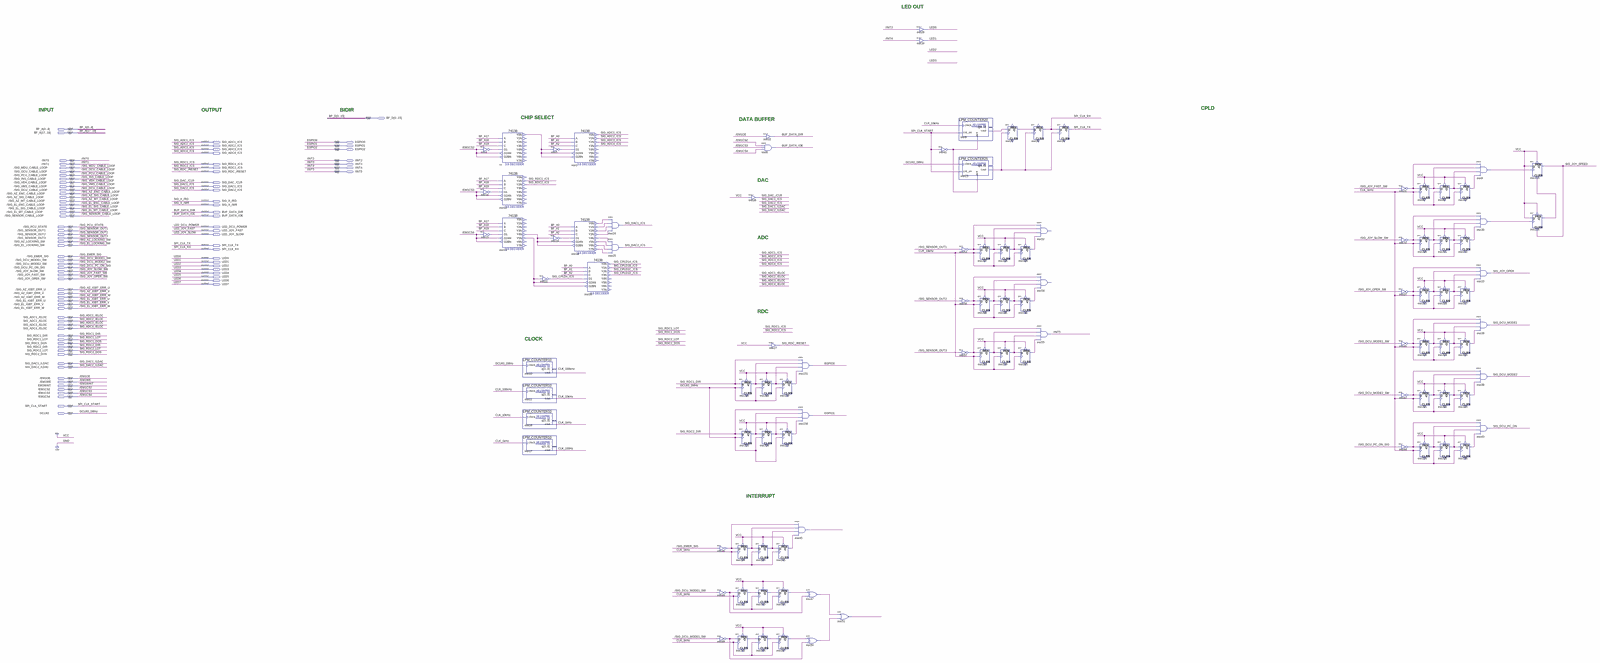
[diagram p0: schematic sheet, whole]
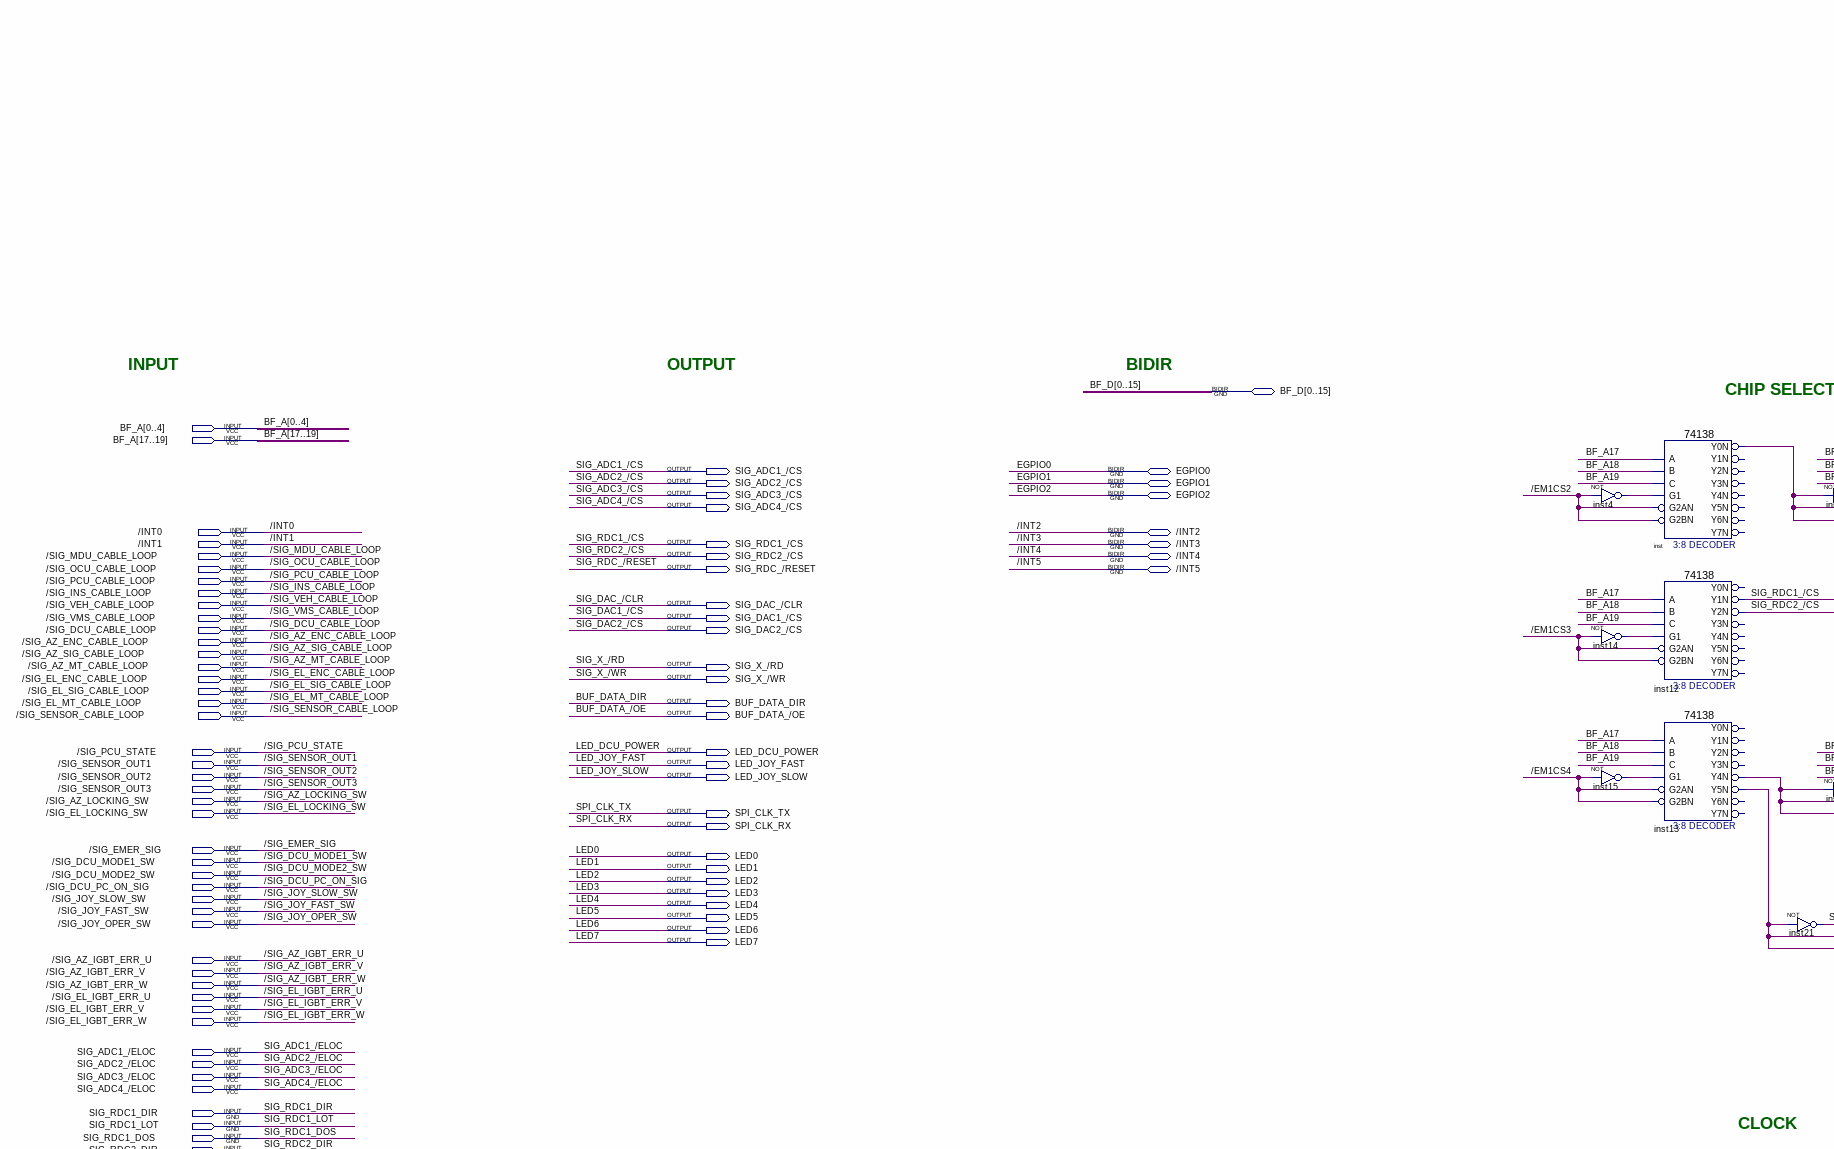
[diagram p1: schematic sheet, upper left part]
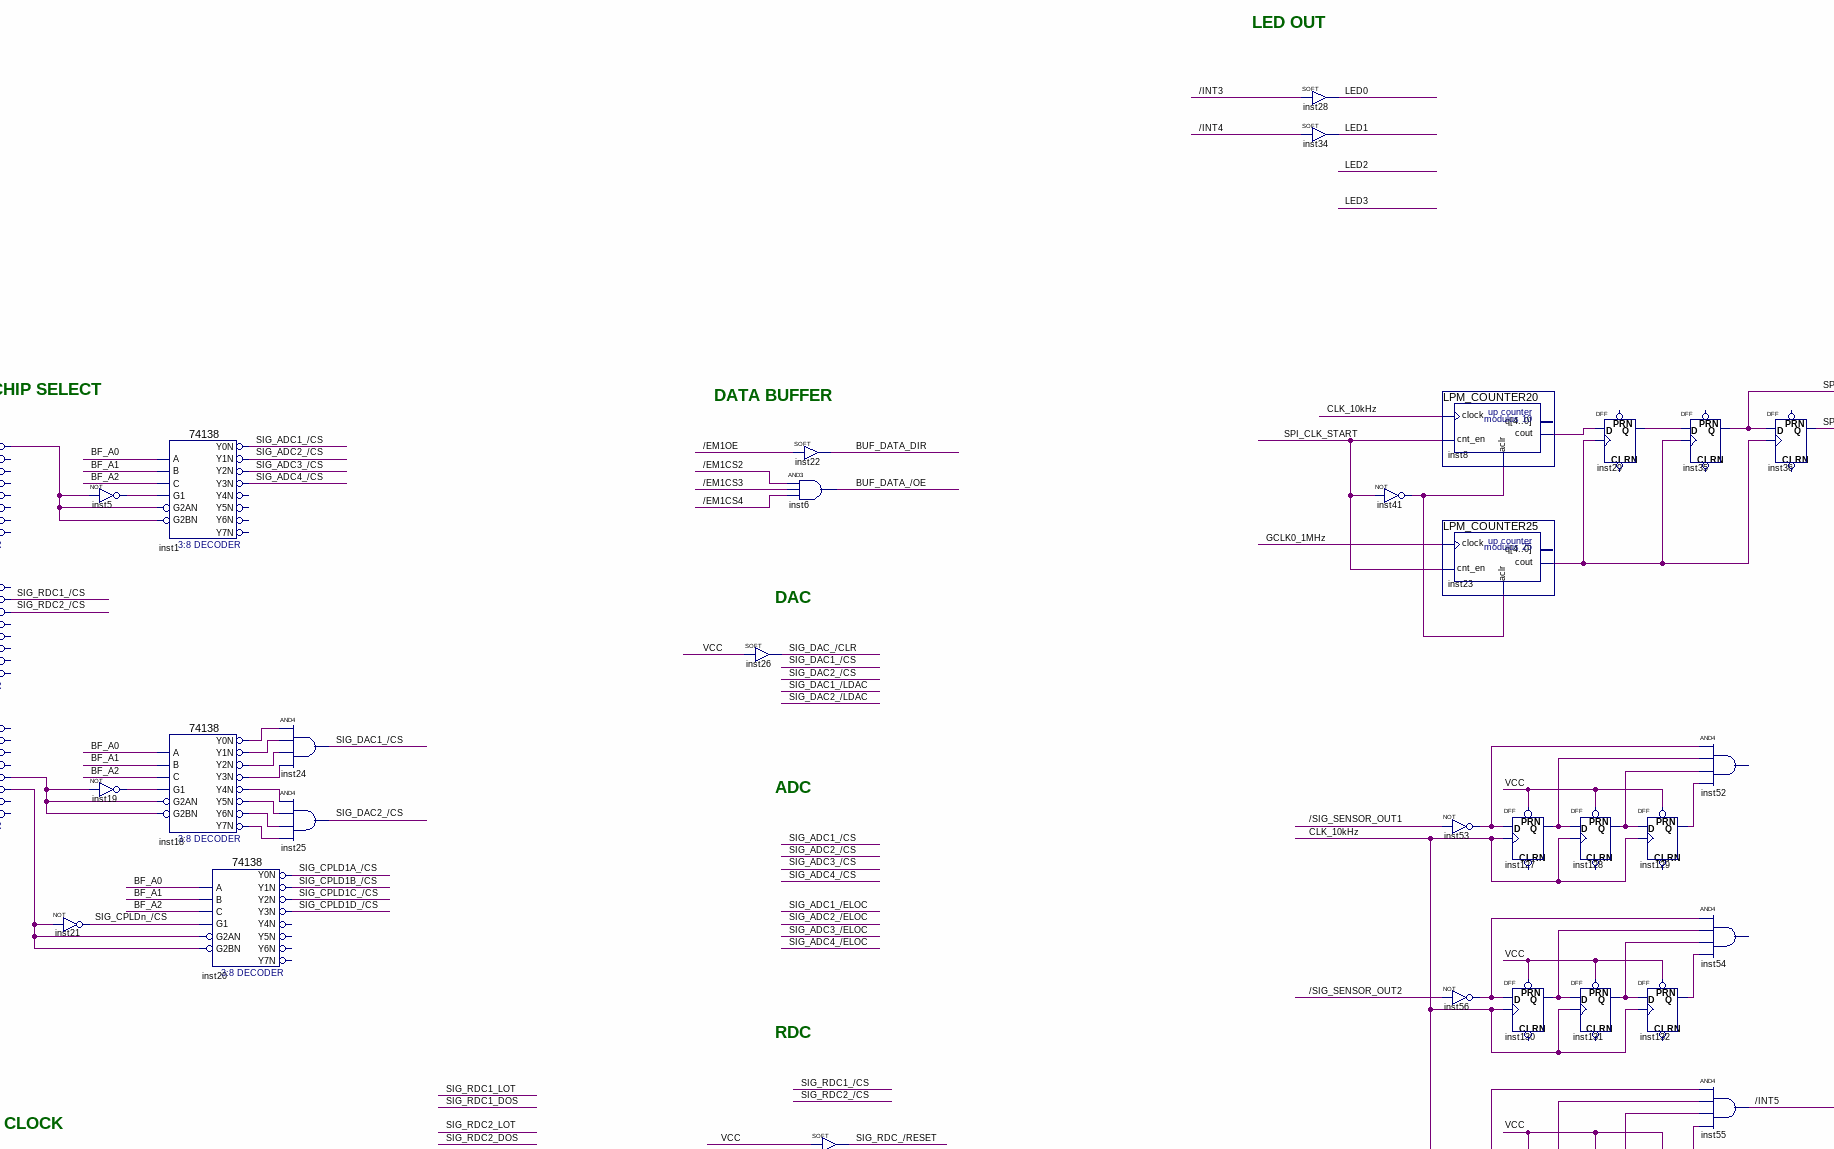
[diagram p2: schematic sheet, upper centre part]
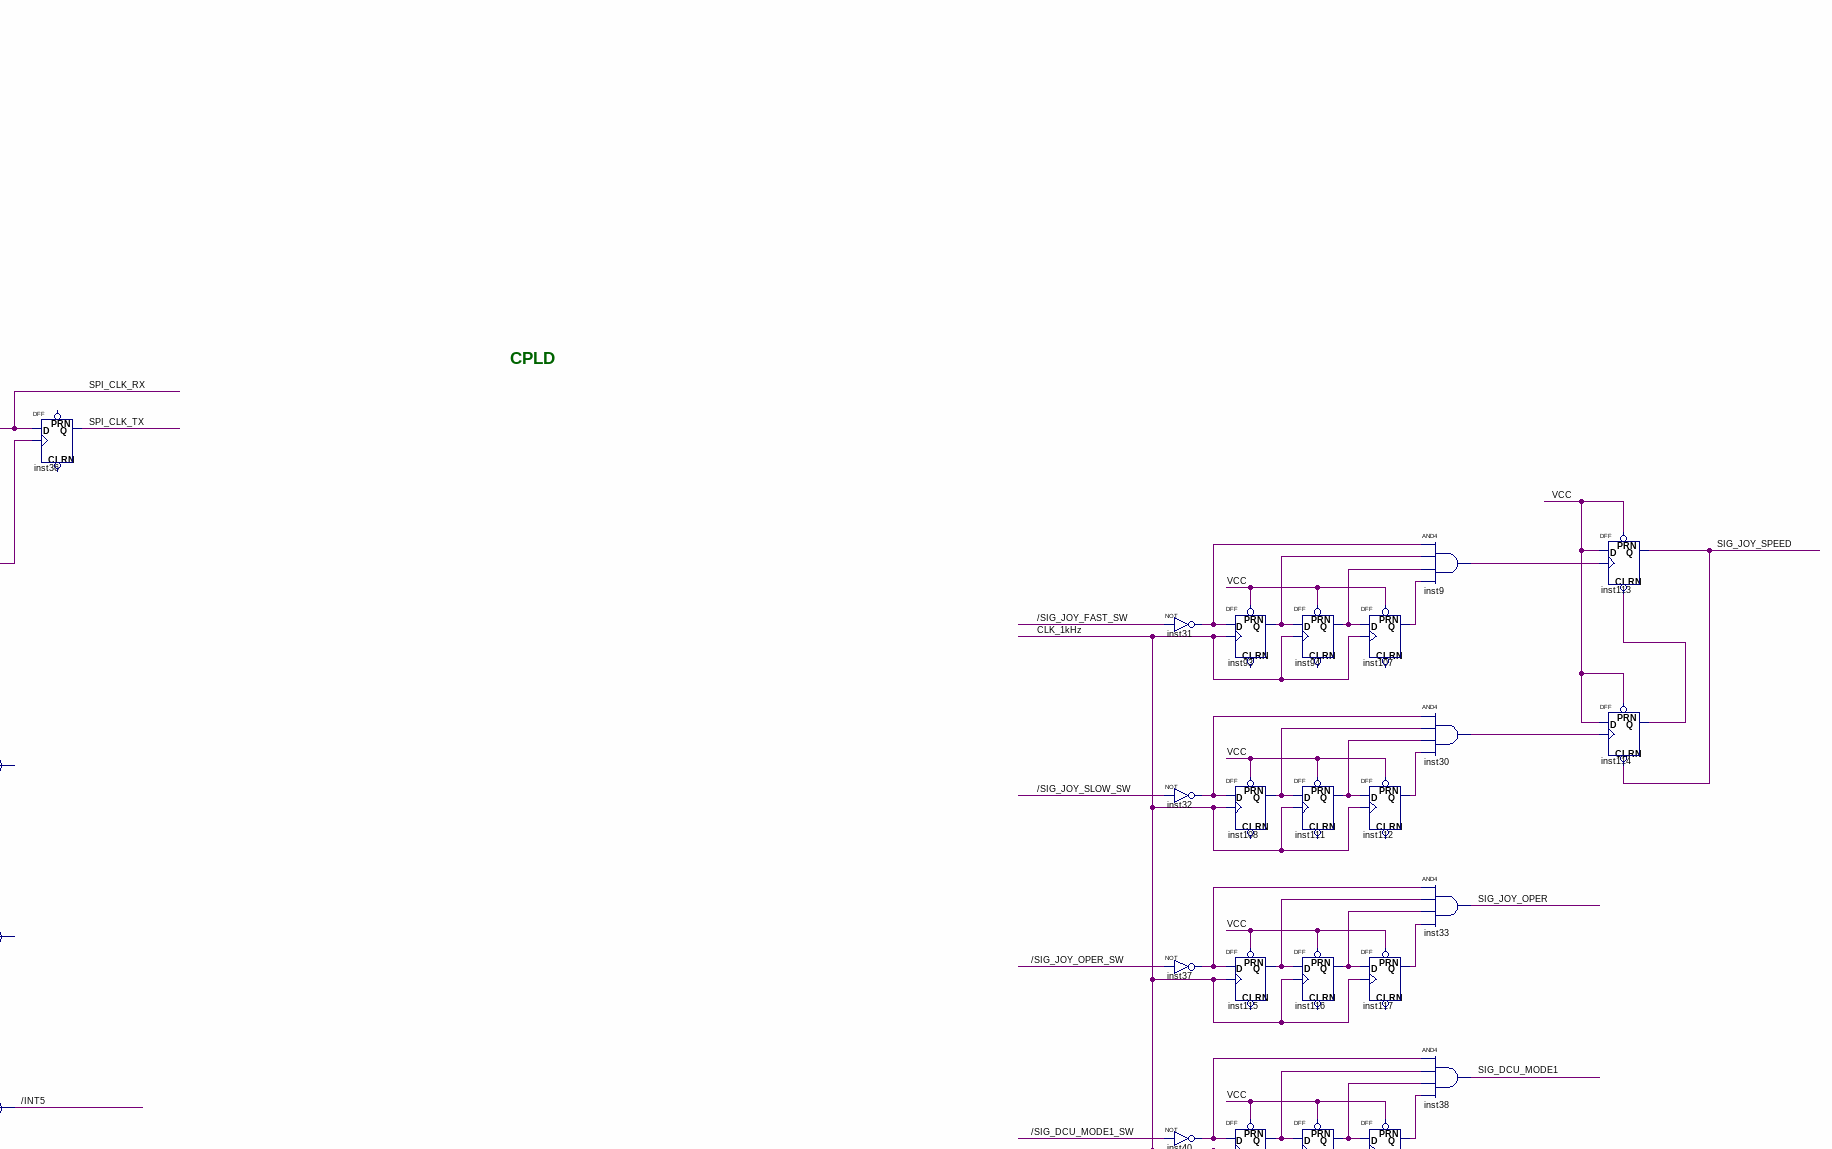
[diagram p3: schematic sheet, upper right part]
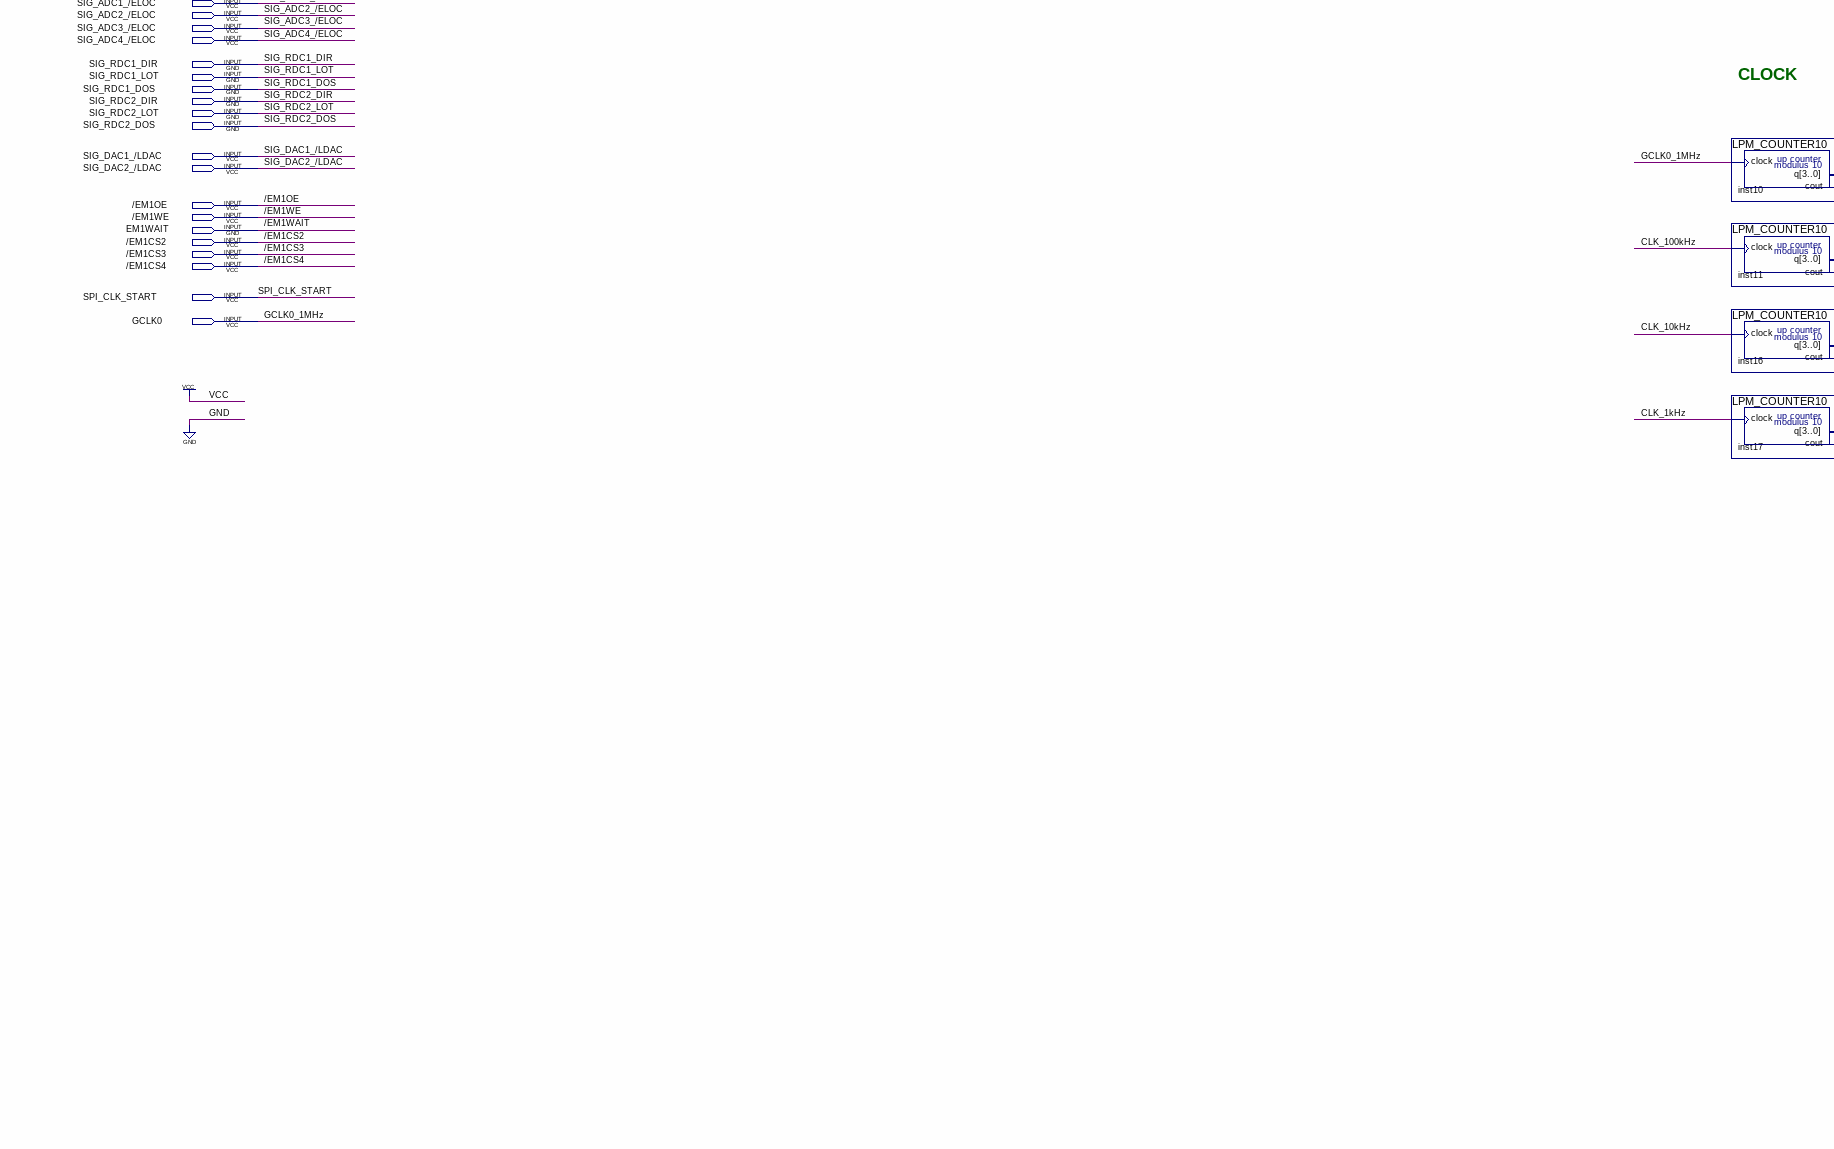
[diagram p4: schematic sheet, lower left part]
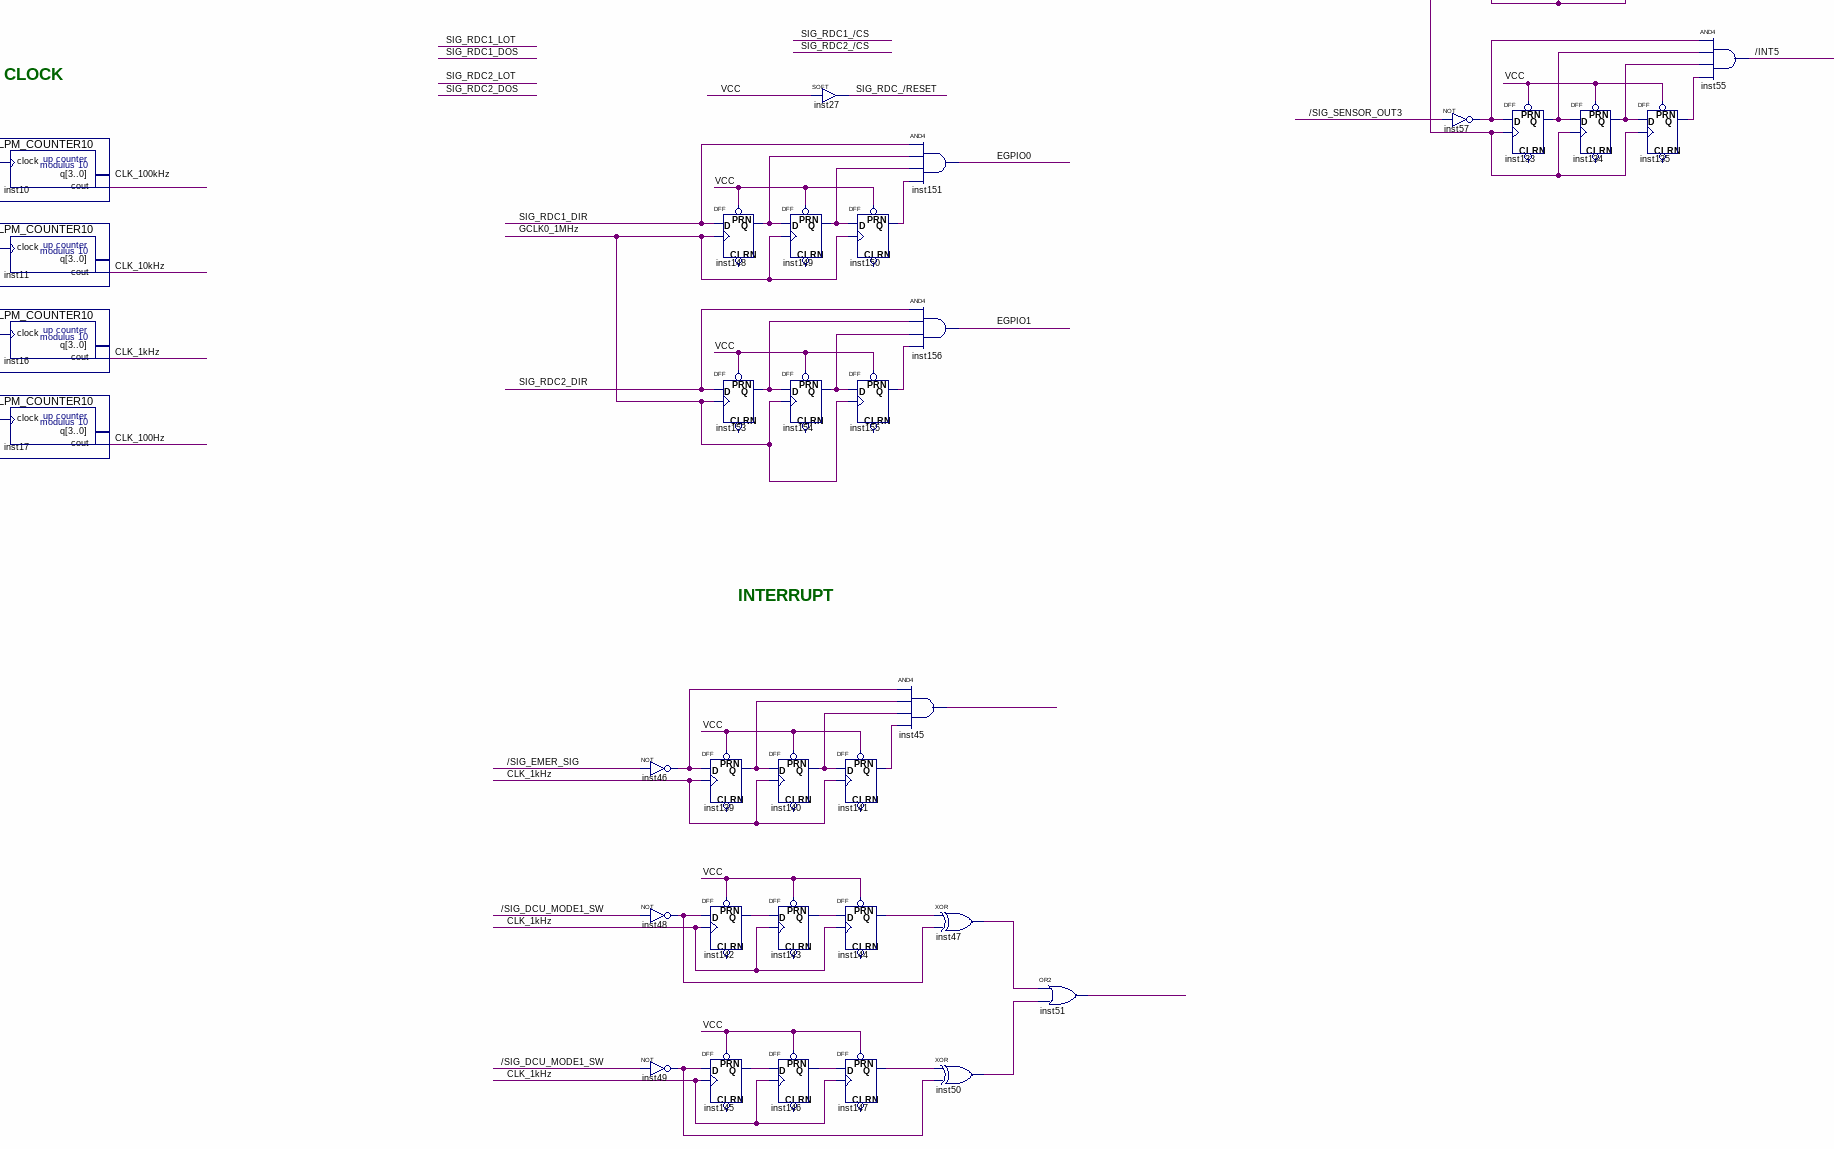
[diagram p5: schematic sheet, lower centre part]
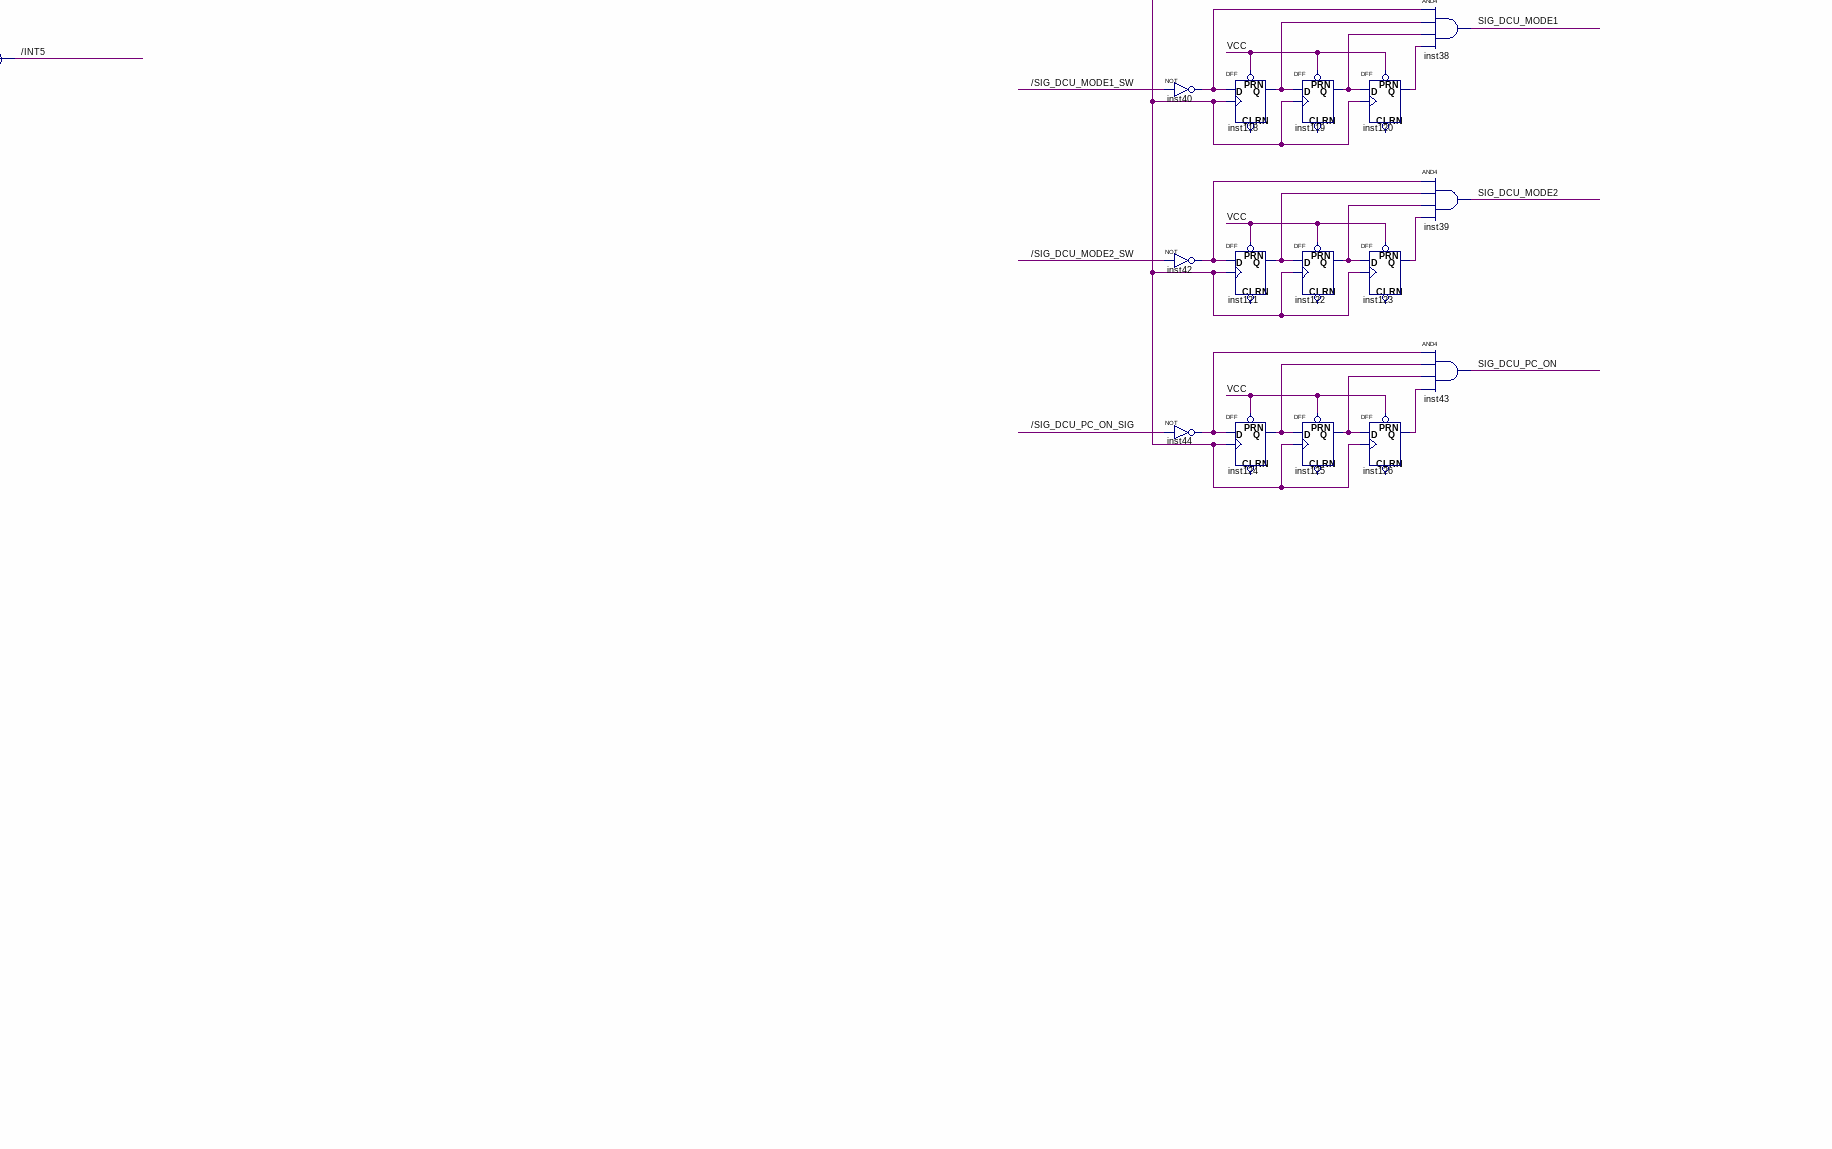
[diagram p6: schematic sheet, lower right part]
// Quartus schematic SPB_CPLD.bdf as structural Verilog: 101 symbols, 92 pins
module SPB_CPLD (
  input  [0:19] BF_A,
  input  \/INT0 ,
  input  \/INT1 ,
  input  \/SIG_MDU_CABLE_LOOP ,
  input  \/SIG_OCU_CABLE_LOOP ,
  input  \/SIG_PCU_CABLE_LOOP ,
  input  \/SIG_INS_CABLE_LOOP ,
  input  \/SIG_VEH_CABLE_LOOP ,
  input  \/SIG_VMS_CABLE_LOOP ,
  input  \/SIG_DCU_CABLE_LOOP ,
  input  \/SIG_AZ_ENC_CABLE_LOOP ,
  input  \/SIG_AZ_SIG_CABLE_LOOP ,
  input  \/SIG_AZ_MT_CABLE_LOOP ,
  input  \/SIG_EL_ENC_CABLE_LOOP ,
  input  \/SIG_EL_SIG_CABLE_LOOP ,
  input  \/SIG_EL_MT_CABLE_LOOP ,
  input  \/SIG_SENSOR_CABLE_LOOP ,
  input  \/SIG_PCU_STATE ,
  input  \/SIG_SENSOR_OUT1 ,
  input  \/SIG_SENSOR_OUT2 ,
  input  \/SIG_SENSOR_OUT3 ,
  input  \/SIG_AZ_LOCKING_SW ,
  input  \/SIG_EL_LOCKING_SW ,
  input  \/SIG_EMER_SIG ,
  input  \/SIG_DCU_MODE1_SW ,
  input  \/SIG_DCU_MODE2_SW ,
  input  \/SIG_DCU_PC_ON_SIG ,
  input  \/SIG_JOY_SLOW_SW ,
  input  \/SIG_JOY_FAST_SW ,
  input  \/SIG_JOY_OPER_SW ,
  input  \/SIG_AZ_IGBT_ERR_U ,
  input  \/SIG_AZ_IGBT_ERR_V ,
  input  \/SIG_AZ_IGBT_ERR_W ,
  input  \/SIG_EL_IGBT_ERR_U ,
  input  \/SIG_EL_IGBT_ERR_V ,
  input  \/SIG_EL_IGBT_ERR_W ,
  input  \SIG_ADC1_/ELOC ,
  input  \SIG_ADC2_/ELOC ,
  input  \SIG_ADC3_/ELOC ,
  input  \SIG_ADC4_/ELOC ,
  input  SIG_RDC1_DIR,
  input  SIG_RDC1_LOT,
  input  SIG_RDC1_DOS,
  input  SIG_RDC2_DIR,
  input  SIG_RDC2_LOT,
  input  SIG_RDC2_DOS,
  input  \SIG_DAC1_/LDAC ,
  input  \SIG_DAC2_/LDAC ,
  input  \/EM1OE ,
  input  \/EM1WE ,
  input  EM1WAIT,
  input  \/EM1CS2 ,
  input  \/EM1CS3 ,
  input  \/EM1CS4 ,
  input  SPI_CLK_START,
  input  GCLK0,
  inout  [0:15] BF_D,
  inout  EGPIO0,
  inout  EGPIO1,
  inout  EGPIO2,
  inout  \/INT2 ,
  inout  \/INT3 ,
  inout  \/INT4 ,
  inout  \/INT5 ,
  output \SIG_ADC1_/CS ,
  output \SIG_ADC2_/CS ,
  output \SIG_ADC3_/CS ,
  output \SIG_ADC4_/CS ,
  output \SIG_RDC1_/CS ,
  output \SIG_RDC2_/CS ,
  output \SIG_RDC_/RESET ,
  output \SIG_DAC_/CLR ,
  output \SIG_DAC1_/CS ,
  output \SIG_DAC2_/CS ,
  output \SIG_X_/RD ,
  output \SIG_X_/WR ,
  output BUF_DATA_DIR,
  output \BUF_DATA_/OE ,
  output LED_DCU_POWER,
  output LED_JOY_FAST,
  output LED_JOY_SLOW,
  output SPI_CLK_TX,
  output SPI_CLK_RX,
  output LED0,
  output LED1,
  output LED2,
  output LED3,
  output LED4,
  output LED5,
  output LED6,
  output LED7
);

  wire CLK_1kHz, CLK_10kHz, CLK_100Hz, CLK_100kHz, inst4_out, inst5_out, inst8_cout, inst9_out, inst13_y4n,
       inst13_y5n, inst14_out, inst15_out, inst18_y0n, inst18_y1n, inst18_y2n, inst18_y3n, inst18_y4n,
       inst18_y5n, inst18_y6n, inst18_y7n, inst19_out, inst23_cout, inst29_q, inst30_out, inst31_out,
       inst32_out, inst37_out, inst40_out, inst41_out, inst42_out, inst44_out, inst45_out, inst46_out,
       inst47_out, inst48_out, inst49_out, inst50_out, inst51_out, inst53_out, inst56_out, inst57_out,
       inst93_q, inst94_q, inst107_q, inst108_q, inst111_q, inst112_q, inst114_q, inst115_q, inst116_q,
       inst117_q, inst118_q, inst119_q, inst120_q, inst121_q, inst122_q, inst123_q, inst124_q, inst125_q,
       inst126_q, inst127_q, inst128_q, inst129_q, inst130_q, inst131_q, inst132_q, inst133_q, inst134_q,
       inst135_q, inst139_q, inst140_q, inst141_q, inst142_q, inst143_q, inst144_q, inst145_q, inst146_q,
       inst147_q, inst148_q, inst149_q, inst150_q, inst153_q, inst154_q, inst155_q, inst_y0n,
       \SIG_CPLD1A_/CS , \SIG_CPLD1B_/CS , \SIG_CPLD1C_/CS , \SIG_CPLD1D_/CS , \SIG_CPLDn_/CS ,
       SIG_DCU_MODE1, SIG_DCU_MODE2, SIG_DCU_PC_ON, SIG_JOY_OPER, SIG_JOY_SPEED;

  not inst4 (inst4_out, \/EM1CS2 );
  not inst14 (inst14_out, \/EM1CS3 );
  not inst15 (inst15_out, \/EM1CS4 );
  \74138  inst (
    .A(BF_A[17]), .B(BF_A[18]), .G1(inst4_out), .C(BF_A[19]), .G2AN(\/EM1CS2 ), .G2BN(\/EM1CS2 ),
    .Y0N(inst_y0n));  // open: Y1N, Y2N, Y3N, Y4N, Y5N, Y6N, Y7N
  \74138  inst12 (
    .A(BF_A[17]), .B(BF_A[18]), .G1(inst14_out), .C(BF_A[19]), .G2AN(\/EM1CS3 ), .G2BN(\/EM1CS3 ),
    .Y1N(\SIG_RDC1_/CS ), .Y2N(\SIG_RDC2_/CS ));  // open: Y0N, Y3N, Y4N, Y5N, Y6N, Y7N
  \74138  inst13 (
    .A(BF_A[17]), .B(BF_A[18]), .G1(inst15_out), .C(BF_A[19]), .G2AN(\/EM1CS4 ), .G2BN(\/EM1CS4 ),
    .Y4N(inst13_y4n), .Y5N(inst13_y5n));  // open: Y0N, Y1N, Y2N, Y3N, Y6N, Y7N
  LPM_COUNTER10 inst10 (.clock(GCLK0), .cout(CLK_100kHz));  // open: q
  LPM_COUNTER10 inst11 (.clock(CLK_100kHz), .cout(CLK_10kHz));  // open: q
  LPM_COUNTER10 inst16 (.clock(CLK_10kHz), .cout(CLK_1kHz));  // open: q
  LPM_COUNTER10 inst17 (.clock(CLK_1kHz), .cout(CLK_100Hz));  // open: q
  not inst5 (inst5_out, inst_y0n);
  not inst19 (inst19_out, inst13_y4n);
  not inst21 (\SIG_CPLDn_/CS , inst13_y5n);
  \74138  inst1 (
    .A(BF_A[0]), .B(BF_A[1]), .G1(inst5_out), .C(BF_A[2]), .G2AN(inst_y0n), .G2BN(inst_y0n),
    .Y0N(\SIG_ADC1_/CS ), .Y1N(\SIG_ADC2_/CS ), .Y2N(\SIG_ADC3_/CS ), .Y3N(\SIG_ADC4_/CS ));  // open: Y4N, Y5N, Y6N, Y7N
  \74138  inst18 (
    .A(BF_A[0]), .B(BF_A[1]), .G1(inst19_out), .C(BF_A[2]), .G2AN(inst13_y4n), .G2BN(inst13_y4n),
    .Y0N(inst18_y0n), .Y1N(inst18_y1n), .Y2N(inst18_y2n), .Y3N(inst18_y3n), .Y4N(inst18_y4n),
    .Y5N(inst18_y5n), .Y6N(inst18_y6n), .Y7N(inst18_y7n));
  \74138  inst20 (
    .A(BF_A[0]), .B(BF_A[1]), .G1(\SIG_CPLDn_/CS ), .C(BF_A[2]), .G2AN(inst13_y5n), .G2BN(inst13_y5n),
    .Y0N(\SIG_CPLD1A_/CS ), .Y1N(\SIG_CPLD1B_/CS ), .Y2N(\SIG_CPLD1C_/CS ), .Y3N(\SIG_CPLD1D_/CS ));  // open: Y4N, Y5N, Y6N, Y7N
  and inst24 (\SIG_DAC1_/CS , inst18_y0n, inst18_y1n, inst18_y2n, inst18_y3n);
  and inst25 (\SIG_DAC2_/CS , inst18_y4n, inst18_y5n, inst18_y6n, inst18_y7n);
  not inst46 (inst46_out, \/SIG_EMER_SIG );
  not inst48 (inst48_out, \/SIG_DCU_MODE1_SW );
  not inst49 (inst49_out, \/SIG_DCU_MODE1_SW );
  DFF inst148 (.CLK(GCLK0), .D(SIG_RDC1_DIR), .PRN(1'b1), .Q(inst148_q));  // open: CLRN
  DFF inst153 (.CLK(GCLK0), .D(SIG_RDC2_DIR), .PRN(1'b1), .Q(inst153_q));  // open: CLRN
  DFF inst139 (.CLK(CLK_1kHz), .D(inst46_out), .PRN(1'b1), .Q(inst139_q));  // open: CLRN
  DFF inst142 (.CLK(CLK_1kHz), .D(inst48_out), .PRN(1'b1), .Q(inst142_q));  // open: CLRN
  DFF inst145 (.CLK(CLK_1kHz), .D(inst49_out), .PRN(1'b1), .Q(inst145_q));  // open: CLRN
  SOFT inst26 (.IN(1'b1), .OUT(\SIG_DAC_/CLR ));
  DFF inst149 (.CLK(GCLK0), .D(inst148_q), .PRN(1'b1), .Q(inst149_q));  // open: CLRN
  DFF inst154 (.CLK(GCLK0), .D(inst153_q), .PRN(1'b1), .Q(inst154_q));  // open: CLRN
  DFF inst140 (.CLK(CLK_1kHz), .D(inst139_q), .PRN(1'b1), .Q(inst140_q));  // open: CLRN
  DFF inst143 (.CLK(CLK_1kHz), .D(inst142_q), .PRN(1'b1), .Q(inst143_q));  // open: CLRN
  DFF inst146 (.CLK(CLK_1kHz), .D(inst145_q), .PRN(1'b1), .Q(inst146_q));  // open: CLRN
  SOFT inst22 (.IN(\/EM1OE ), .OUT(BUF_DATA_DIR));
  and inst6 (\BUF_DATA_/OE , \/EM1CS2 , \/EM1CS3 , \/EM1CS4 );
  SOFT inst27 (.IN(1'b1), .OUT(\SIG_RDC_/RESET ));
  DFF inst150 (.CLK(GCLK0), .D(inst149_q), .PRN(1'b1), .Q(inst150_q));  // open: CLRN
  DFF inst155 (.CLK(GCLK0), .D(inst154_q), .PRN(1'b1), .Q(inst155_q));  // open: CLRN
  DFF inst141 (.CLK(CLK_1kHz), .D(inst140_q), .PRN(1'b1), .Q(inst141_q));  // open: CLRN
  DFF inst144 (.CLK(CLK_1kHz), .D(inst143_q), .PRN(1'b1), .Q(inst144_q));  // open: CLRN
  DFF inst147 (.CLK(CLK_1kHz), .D(inst146_q), .PRN(1'b1), .Q(inst147_q));  // open: CLRN
  and inst151 (EGPIO0, SIG_RDC1_DIR, inst148_q, inst149_q, inst150_q);
  and inst156 (EGPIO1, SIG_RDC2_DIR, inst153_q, inst154_q, inst155_q);
  and inst45 (inst45_out, inst46_out, inst139_q, inst140_q, inst141_q);
  xor inst47 (inst47_out, inst144_q, inst48_out);
  xor inst50 (inst50_out, inst147_q, inst49_out);
  or inst51 (inst51_out, inst47_out, inst50_out);
  SOFT inst28 (.IN(\/INT3 ), .OUT(LED0));
  SOFT inst34 (.IN(\/INT4 ), .OUT(LED1));
  not inst41 (inst41_out, SPI_CLK_START);
  LPM_COUNTER20 inst8 (.clock(CLK_10kHz), .cnt_en(SPI_CLK_START), .aclr(inst41_out), .cout(inst8_cout));  // open: q
  LPM_COUNTER25 inst23 (.clock(GCLK0), .cnt_en(SPI_CLK_START), .aclr(inst41_out), .cout(inst23_cout));  // open: q
  not inst53 (inst53_out, \/SIG_SENSOR_OUT1 );
  not inst56 (inst56_out, \/SIG_SENSOR_OUT2 );
  not inst57 (inst57_out, \/SIG_SENSOR_OUT3 );
  DFF inst127 (.CLK(CLK_10kHz), .D(inst53_out), .PRN(1'b1), .Q(inst127_q));  // open: CLRN
  DFF inst130 (.CLK(CLK_10kHz), .D(inst56_out), .PRN(1'b1), .Q(inst130_q));  // open: CLRN
  DFF inst133 (.CLK(CLK_10kHz), .D(inst57_out), .PRN(1'b1), .Q(inst133_q));  // open: CLRN
  DFF inst29 (.CLK(inst23_cout), .D(inst8_cout), .Q(inst29_q));  // open: CLRN, PRN
  DFF inst128 (.CLK(CLK_10kHz), .D(inst127_q), .PRN(1'b1), .Q(inst128_q));  // open: CLRN
  DFF inst131 (.CLK(CLK_10kHz), .D(inst130_q), .PRN(1'b1), .Q(inst131_q));  // open: CLRN
  DFF inst134 (.CLK(CLK_10kHz), .D(inst133_q), .PRN(1'b1), .Q(inst134_q));  // open: CLRN
  DFF inst129 (.CLK(CLK_10kHz), .D(inst128_q), .PRN(1'b1), .Q(inst129_q));  // open: CLRN
  DFF inst132 (.CLK(CLK_10kHz), .D(inst131_q), .PRN(1'b1), .Q(inst132_q));  // open: CLRN
  DFF inst135 (.CLK(CLK_10kHz), .D(inst134_q), .PRN(1'b1), .Q(inst135_q));  // open: CLRN
  DFF inst35 (.CLK(inst23_cout), .D(inst29_q), .Q(SPI_CLK_RX));  // open: CLRN, PRN
  // AND4 inst52 has open pins: IN1=inst53_out, IN2=inst127_q, IN3=inst128_q, IN4=inst129_q, OUT=open
  // AND4 inst54 has open pins: IN1=inst56_out, IN2=inst130_q, IN3=inst131_q, IN4=inst132_q, OUT=open
  and inst55 (\/INT5 , inst57_out, inst133_q, inst134_q, inst135_q);
  DFF inst36 (.CLK(inst23_cout), .D(SPI_CLK_RX), .Q(SPI_CLK_TX));  // open: CLRN, PRN
  not inst31 (inst31_out, \/SIG_JOY_FAST_SW );
  not inst32 (inst32_out, \/SIG_JOY_SLOW_SW );
  not inst37 (inst37_out, \/SIG_JOY_OPER_SW );
  not inst40 (inst40_out, \/SIG_DCU_MODE1_SW );
  not inst42 (inst42_out, \/SIG_DCU_MODE2_SW );
  not inst44 (inst44_out, \/SIG_DCU_PC_ON_SIG );
  DFF inst93 (.CLK(CLK_1kHz), .D(inst31_out), .PRN(1'b1), .Q(inst93_q));  // open: CLRN
  DFF inst108 (.CLK(CLK_1kHz), .D(inst32_out), .PRN(1'b1), .Q(inst108_q));  // open: CLRN
  DFF inst115 (.CLK(CLK_1kHz), .D(inst37_out), .PRN(1'b1), .Q(inst115_q));  // open: CLRN
  DFF inst118 (.CLK(CLK_1kHz), .D(inst40_out), .PRN(1'b1), .Q(inst118_q));  // open: CLRN
  DFF inst121 (.CLK(CLK_1kHz), .D(inst42_out), .PRN(1'b1), .Q(inst121_q));  // open: CLRN
  DFF inst124 (.CLK(CLK_1kHz), .D(inst44_out), .PRN(1'b1), .Q(inst124_q));  // open: CLRN
  DFF inst94 (.CLK(CLK_1kHz), .D(inst93_q), .PRN(1'b1), .Q(inst94_q));  // open: CLRN
  DFF inst111 (.CLK(CLK_1kHz), .D(inst108_q), .PRN(1'b1), .Q(inst111_q));  // open: CLRN
  DFF inst116 (.CLK(CLK_1kHz), .D(inst115_q), .PRN(1'b1), .Q(inst116_q));  // open: CLRN
  DFF inst119 (.CLK(CLK_1kHz), .D(inst118_q), .PRN(1'b1), .Q(inst119_q));  // open: CLRN
  DFF inst122 (.CLK(CLK_1kHz), .D(inst121_q), .PRN(1'b1), .Q(inst122_q));  // open: CLRN
  DFF inst125 (.CLK(CLK_1kHz), .D(inst124_q), .PRN(1'b1), .Q(inst125_q));  // open: CLRN
  DFF inst107 (.CLK(CLK_1kHz), .D(inst94_q), .PRN(1'b1), .Q(inst107_q));  // open: CLRN
  DFF inst112 (.CLK(CLK_1kHz), .D(inst111_q), .PRN(1'b1), .Q(inst112_q));  // open: CLRN
  DFF inst117 (.CLK(CLK_1kHz), .D(inst116_q), .PRN(1'b1), .Q(inst117_q));  // open: CLRN
  DFF inst120 (.CLK(CLK_1kHz), .D(inst119_q), .PRN(1'b1), .Q(inst120_q));  // open: CLRN
  DFF inst123 (.CLK(CLK_1kHz), .D(inst122_q), .PRN(1'b1), .Q(inst123_q));  // open: CLRN
  DFF inst126 (.CLK(CLK_1kHz), .D(inst125_q), .PRN(1'b1), .Q(inst126_q));  // open: CLRN
  and inst9 (inst9_out, inst31_out, inst93_q, inst94_q, inst107_q);
  and inst30 (inst30_out, inst32_out, inst108_q, inst111_q, inst112_q);
  and inst33 (SIG_JOY_OPER, inst37_out, inst115_q, inst116_q, inst117_q);
  and inst38 (SIG_DCU_MODE1, inst40_out, inst118_q, inst119_q, inst120_q);
  and inst39 (SIG_DCU_MODE2, inst42_out, inst121_q, inst122_q, inst123_q);
  and inst43 (SIG_DCU_PC_ON, inst44_out, inst124_q, inst125_q, inst126_q);
  DFF inst113 (.CLRN(inst114_q), .CLK(inst9_out), .D(1'b1), .PRN(1'b1), .Q(SIG_JOY_SPEED));
  DFF inst114 (.CLRN(SIG_JOY_SPEED), .CLK(inst30_out), .D(1'b1), .PRN(1'b1), .Q(inst114_q));

  // Other names for the same wires on the sheet: /EM1WAIT = EM1WAIT; GCLK0_1MHz = GCLK0

  // Notes on the sheet:
  //   LED OUT
  //   CPLD
  //   INPUT
  //   OUTPUT
  //   BIDIR
  //   CHIP SELECT
  //   DATA BUFFER
  //   DAC
  //   ADC
  //   RDC
  //   CLOCK
  //   INTERRUPT
endmodule
